# Altium schematic sheet BLUENRG-M2SP.SchDoc
size A4
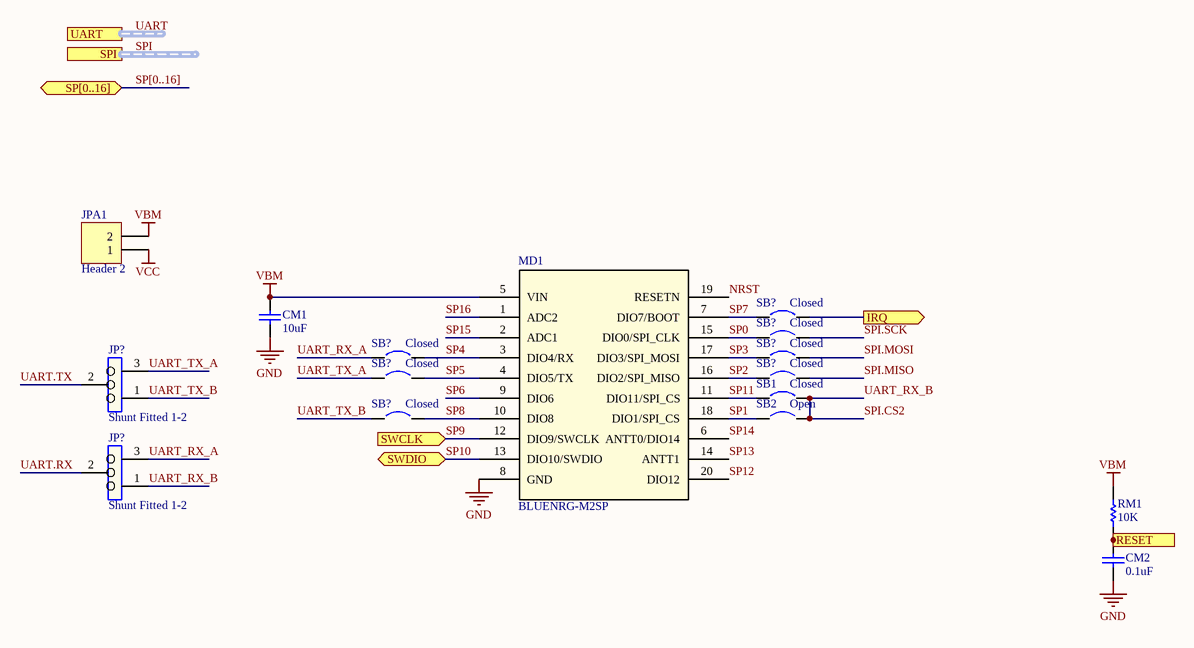
[diagram p0: BLUENRG-M2SP.SchDoc]

## Parts
(Parts that share a designator on the sheet are numbered #1, #2 ... from top to bottom, then left to right.)
CM1  value 10uF  [C0603[1608X92]]  (hidden comment: 10uF 6.3V 0603)
CM2  value 0.1uF  [C0603[1608X92]]  (hidden comment: 0.1uF 16V 0603)
JP?#1  value Shunt Fitted 1-2  [HDR1X3]  (hidden comment: Jumper_Header 3x1 Fitted 1-2)
JP?#2  value Shunt Fitted 1-2  [HDR1X3]  (hidden comment: Jumper_Header 3x1 Fitted 1-2)
JPA1  Header 2  [HDR1X2]
MD1  BLUENRG-M2SP  [BLUENRG-M2SP]
RM1  value 10K  [R0603[1608]]  (hidden comment: 10K 1% 0603)
SB1  Closed  [SB_0603]
SB2  Open  [SB_0603]
SB?#1  Closed  [SB_0603]
SB?#2  Closed  [SB_0603]
SB?#3  Closed  [SB_0603]
SB?#4  Closed  [SB_0603]
SB?#5  Closed  [SB_0603]
SB?#6  Closed  [SB_0603]
SB?#7  Closed  [SB_0603]

## Ports
IRQ (out), RESET (in), SP[0..16] (bidir), SPI (harness SPI), SWCLK (in), SWDIO (bidir), UART (harness USART2)

## Nets
GND: CM1.2 CM2.2 MD1.8(GND)
VBM: CM1.1 JPA1.2 MD1.5(VIN) RM1.2
VCC: JPA1.1
IRQ: SB?#1.2 ; port IRQ
NRST: MD1.19(RESETN)
RESET: CM2.1 RM1.1 ; port RESET
SP0: MD1.15(DIO0/SPI_CLK) SB?#2.1
SP1: MD1.18(DIO1/SPI_CS) SB2.1
SP2: MD1.16(DIO2/SPI_MISO) SB?#6.1
SP3: MD1.17(DIO3/SPI_MOSI) SB?#4.1
SP4: MD1.3(DIO4/RX) SB?#3.2
SP5: MD1.4(DIO5/TX) SB?#5.2
SP6: MD1.9(DIO6)
SP7: MD1.7(DIO7/BOOT) SB?#1.1
SP8: MD1.10(DIO8) SB?#7.2
SP9: MD1.12(DIO9/SWCLK) ; port SWCLK
SP10: MD1.13(DIO10/SWDIO) ; port SWDIO
SP11: MD1.11(DIO11/SPI_CS) SB1.1
SP12: MD1.20(DIO12)
SP13: MD1.14(ANTT1)
SP14: MD1.6(ANTT0/DIO14)
SP15: MD1.2(ADC1)
SP16: MD1.1(ADC2)
SPI.CS2: JP?#2.1 SB1.2 SB2.2  [also labelled UART_RX_B]
SPI.MISO: SB?#6.2
SPI.MOSI: SB?#4.2
SPI.SCK: SB?#2.2
UART.RX: JP?#2.2
UART.TX: JP?#1.2
UART_RX_A: JP?#2.3 SB?#3.1
UART_TX_A: JP?#1.3 SB?#5.1
UART_TX_B: JP?#1.1 SB?#7.1

## Buses and harness runs
bus SP[0..16] = port SP[0..16]
harness SPI = port SPI
harness UART = port UART

## Library data of the parts
CM1 = CAP_10uF_6.3V_0603_10%: 10uF 6.3V 10% 0603 (1608 Metric); PartNumber: GRM188R60J106KE47D; Manufacturer: Murata; TemperatureCoefficient: X5R; Mounting Technology: Surface Mount; PackageReference: 0603; PackageDescription: 0603 (1608 Metric); Voltage: 6.3V; Tolerance: 10%
CM2 = CAP_0.1uF_16V_0603_10%: 0.1uF 16V 10% 0603 (1608 Metric); PartNumber: GCM188R71C104KA37D; Manufacturer: Murata; TemperatureCoefficient: X7R; Mounting Technology: Surface Mount; PackageReference: 0603; PackageDescription: 0603 (1608 Metric); Voltage: 16V; Tolerance: 10%
JP?#1 JP?#2 = Jumper_Header 3x1 Fitted 1-2: Header, 3x1, 2,54mm, VR, TH, Height 5.84mm/2.54mm - Shunt Fitted 1-2 by default; Internal_Part_Number: MCD-00684; Part_Type: Connector; Manufacturer_Part_Number: TSW-103-07-F-S; Manufacturer: SAMTEC; Provided_By: SUBCO; Status: Released; ComponentLink1Description: Datasheet; ComponentLink1URL: http://tunmcdsvn.tun.st.com/Component_Datasheet_Library/Trunk/Connectors/Samtec_TSW-HTSW-series; ECCN_US: n/a; ECCN_EU: n/a
JPA1 = Header 2: Header, 2-Pin; LatestRevisionDate: 17-Jul-2002; LatestRevisionNote: Re-released for DXP Platform.; Publisher: Altium Limited
MD1 = BLUENRG-M2SP: Manufacturer: STMicroelectronics; PartNumber: BLUENRG-M2SP
RM1 = RES_10K_0603_1%: 10K 0.25W 1% 0603 (1005 Metric); Manufacturer: Vishay / Dale; PartNumber: CRCW060310K0FKEAHP; Tolerance: 1%; Power: 0.25W; Mounting Technology: Surface Mount; PackageReference: 0603; PackageDescription: 0603 (1608 Metric); ComponentLink1Description: Datasheet; ComponentLink1URL: http://www.vishay.com/docs/20065/rcse3.pdf
SB1 SB?#1-SB?#7 = Circuit Breaker_close: Circuit Breaker; Published: 24-Mar-1999; Revision: July-2002: Re-released for DXP Platform.; Publisher: Altium Limited
SB2 = Circuit Breaker: Published: 24-Mar-1999; Revision: July-2002: Re-released for DXP Platform.; Publisher: Altium Limited